# EAGLE schematic gsm_sim800L (EAGLE 9.3.0)
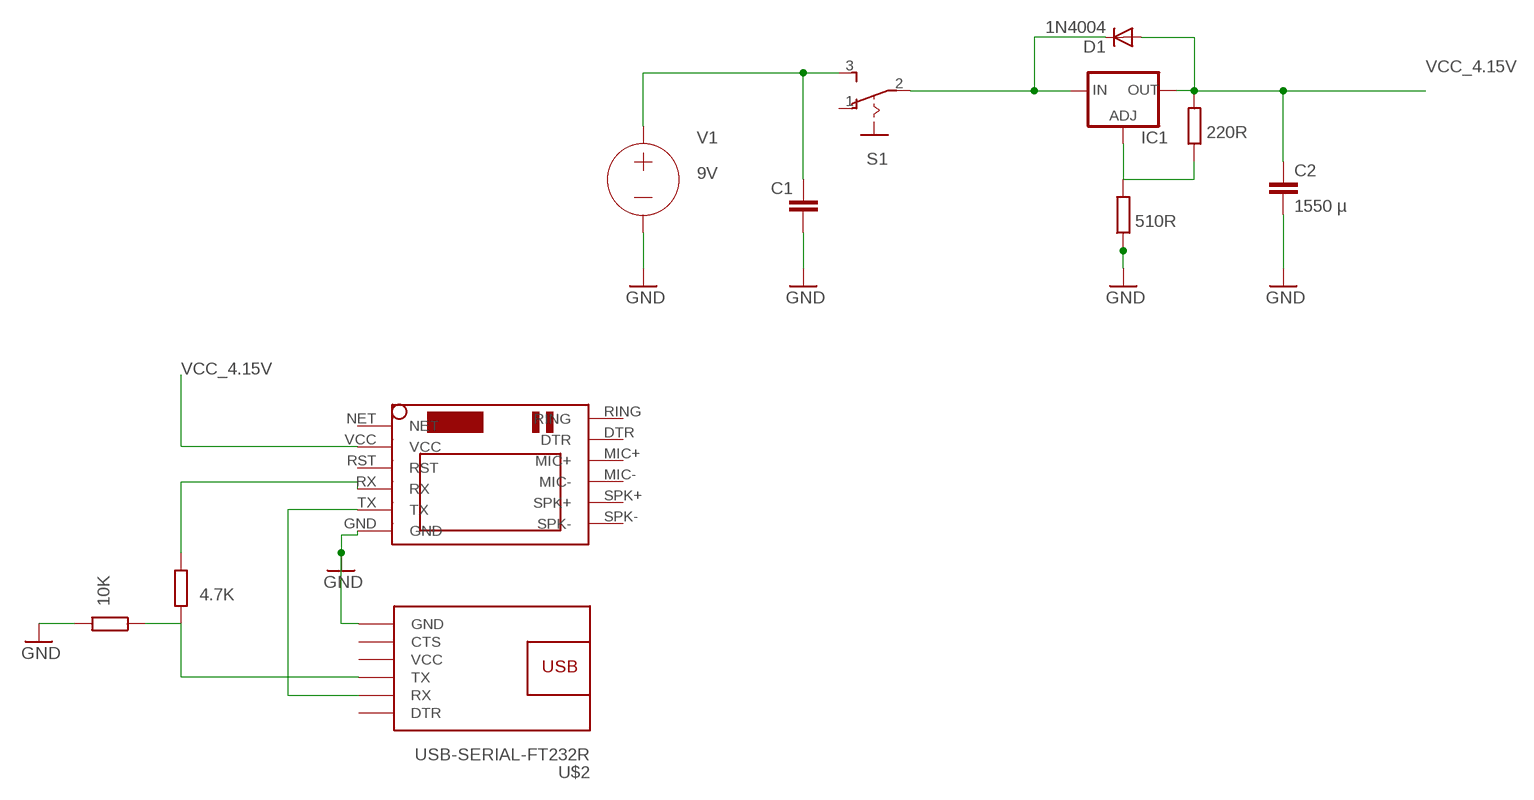
[diagram p0: schematic, sheet 1]
R1 (R): VAL: 220R
R2 (R): VAL: 510R
R3 (R): VAL: 10K
R4 (R): VAL: 4.7K

## Parts
C1  C10/5  [C10B5]
C2  1550 µ  C10/5  [C10B5]
D1  1N4004  [DO41-10]
IC1  LM317TL  [317TL]
S1  255SB  [255SB]
U$1  SIM800LMODULE  [SIM800LMODULE]
U$2  USB-SERIAL-FT232R  [USB-SERIAL-FT232R]
V1  9V  VOLTAGE  (no package)

## Nets
GND: C1.2 C2.2 U$1.GND U$2.6(GND) V1.-
N$1: C1.1 S1.3(S) V1.+
N$2: D1.C IC1.3(IN) S1.2(P)
N$3: U$1.TX U$2.2(RX)
N$4: IC1.1(ADJ)
N$7: U$2.3(TX)
N$8: U$1.RX
VCC_4.15V: C2.1 D1.A IC1.2(OUT) U$1.VCC
Unconnected: S1.1(O) U$1.DTR U$1.MIC+ U$1.MIC- U$1.NET U$1.RING U$1.RST U$1.SPK+ U$1.SPK- U$2.1(DTR) U$2.5(CTS)

## Power pins joined to a net without a drawn wire
VCC: U$2.4(VCC)

## Library data of the parts
C1 C2 = capacitor-wima:C: CAPACITOR naming: grid - package width
D1 = adafruit:1N4004: DIODE General purpose 1N400x type rectifier (With bigger pads) http://www.ladyada.net/library/pcb/eaglelibrary.html
IC1 = v-reg-2:LM317TL: VOLTAGE REGULATOR
S1 = switch:255SB: SLIDING SWITCH Distributor Buerklin, 11G810
U$1 = SIM800LMODULE:SIM800LMODULE: SIM800L Module
U$2 = diy-modules:USB-SERIAL-FT232R: USB to Serial UART Converter based on FT232R chip More information about FT232R chip is available here: http://www.ftdichip.com/Products/ICs/FT232R.htm Click here to find device on ebay.com <http://www.ebay.com/sch/ft232rl+arduino+download+max232>
V1 = ngspice-simulation:VOLTAGE: Independent Voltage Source, either DC, AC, PULSE, SINE, PWL, EXP, or SFFM; VALUE: 0V